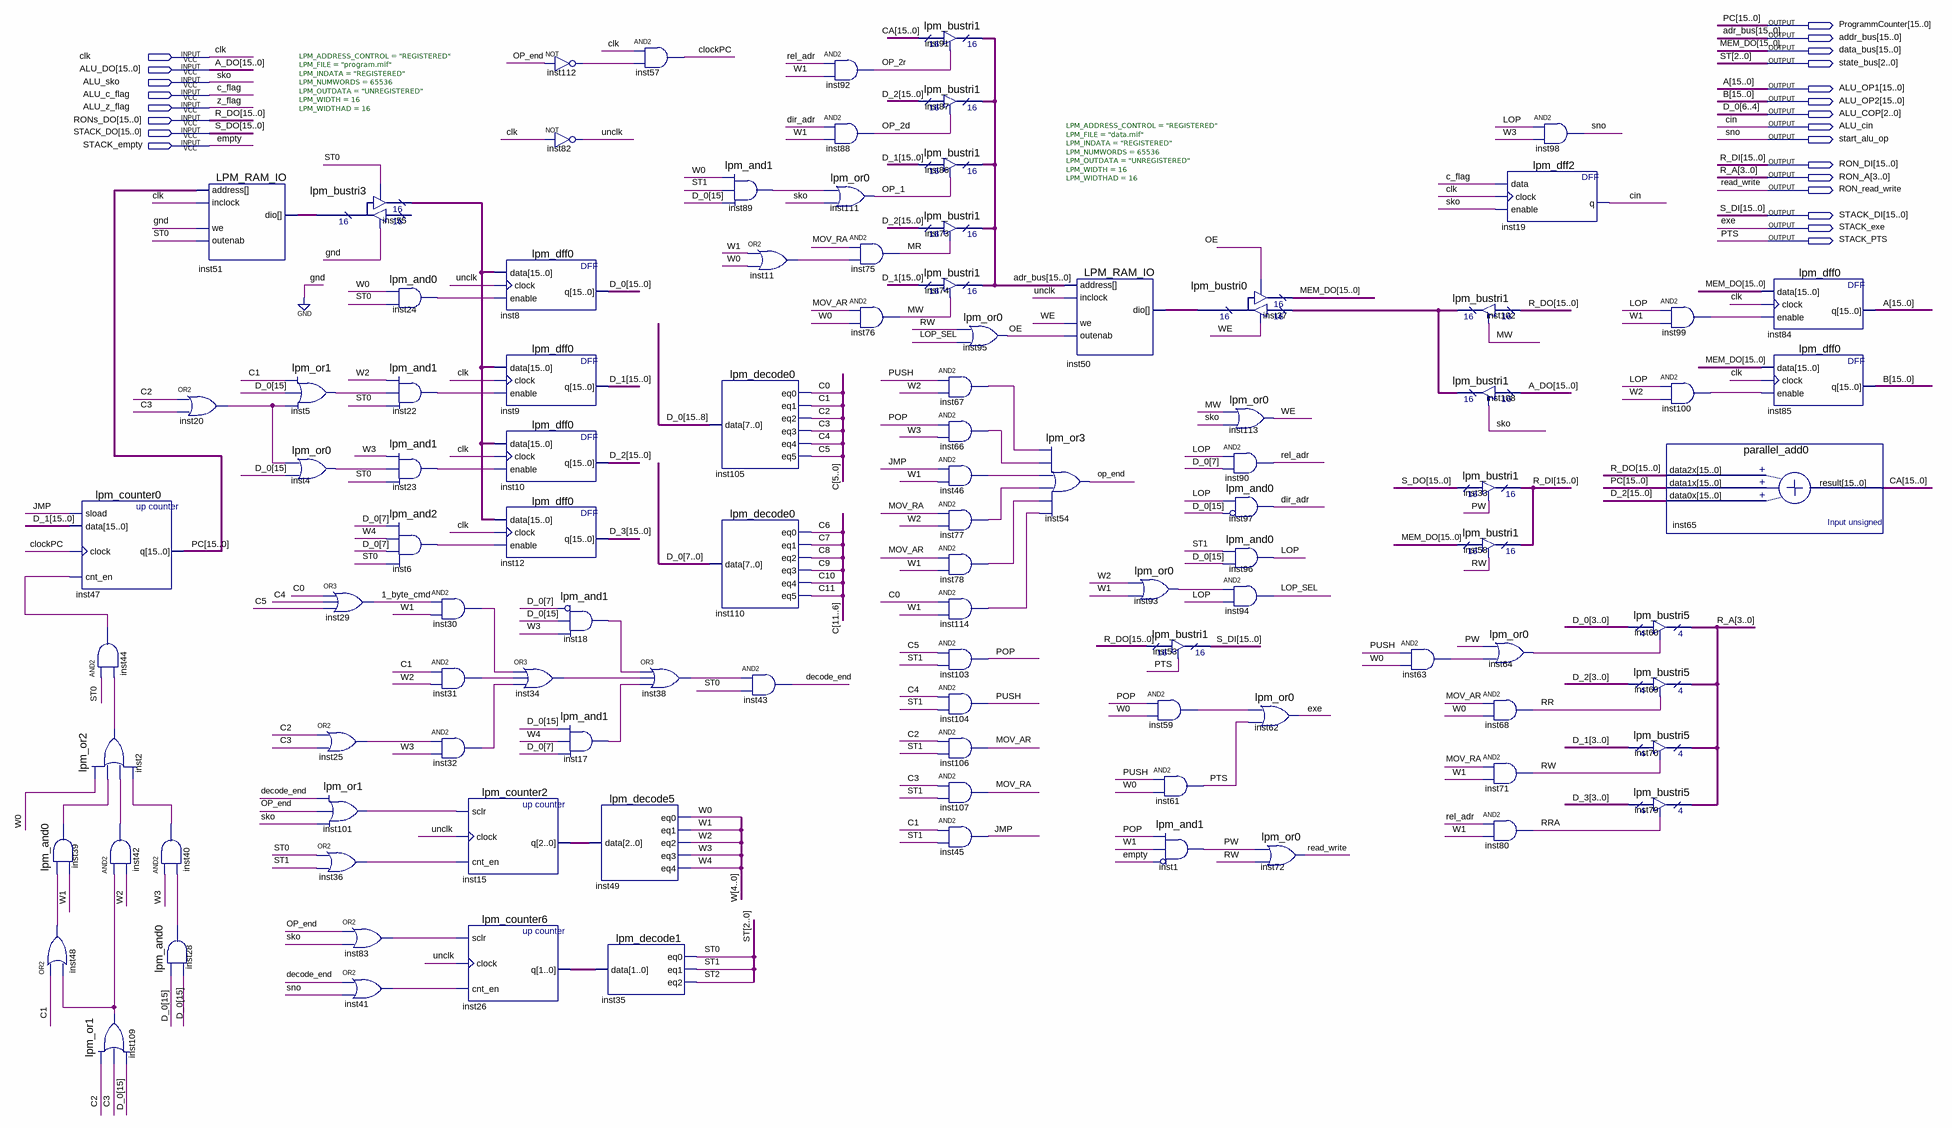
[diagram p0: schematic sheet]
// Quartus schematic CU.bdf as structural Verilog: 104 symbols, 23 pins
module CU (
  input  clk,
  input  [15:0] ALU_DO,
  input  ALU_sko,
  input  ALU_c_flag,
  input  ALU_z_flag,
  input  [15:0] RONs_DO,
  input  [15:0] STACK_DO,
  input  STACK_empty,
  output [15:0] ProgrammCounter,
  output [15:0] addr_bus,
  output [15:0] data_bus,
  output [2:0] state_bus,
  output [15:0] ALU_OP1,
  output [15:0] ALU_OP2,
  output [2:0] ALU_COP,
  output ALU_cin,
  output start_alu_op,
  output [15:0] RON_DI,
  output [3:0] RON_A,
  output RON_read_write,
  output [15:0] STACK_DI,
  output STACK_exe,
  output STACK_PTS
);

  wire \1_byte_cmd , clockPC, decode_end, dir_adr, inst2_result, inst4_result, inst5_result, inst6_result,
       inst11_out, inst17_result, inst18_result, inst20_out, inst22_result, inst23_result, inst24_result,
       inst25_out, inst28_result, inst30_out, inst31_out, inst32_out, inst34_out, inst36_out, inst38_out,
       inst39_result, inst40_out, inst41_out, inst42_out, inst44_out, inst46_out, inst48_out, inst59_out,
       inst63_out, inst64_result, inst66_out, inst67_out, inst77_out, inst78_out, inst83_out, inst89_result,
       inst93_result, inst99_out, inst100_out, inst101_result, inst109_result, inst112_out, inst114_out, JMP,
       LOP, LOP_SEL, MOV_AR, MOV_RA, MR, MW, OE, OP_1, OP_2d, OP_2r, op_end, POP, PUSH, PW, rel_adr, RR, RRA,
       RW, unclk, WE;
  wire [1:0] inst26_q;
  wire [2:0] inst15_q;
  wire [4:0] W;
  wire [11:0] C;
  wire [15:0] CA, D_0, D_1, D_2, D_3, inst50_dio, inst51_dio, inst55_result, inst102_tridata;

  lpm_counter0 inst47 (.sload(JMP), .data(D_1), .clock(clockPC), .cnt_en(inst44_out), .q(ProgrammCounter));
  lpm_and0 inst39 (.data0(inst48_out), .data1(W[1]), .result(inst39_result));
  or inst48 (inst48_out, C[1], inst109_result);
  and inst44 (inst44_out, state_bus[0], inst2_result);
  lpm_or2 inst2 (.data0(W[0]), .data1(inst39_result), .data2(inst42_out), .data3(inst40_out), .result(inst2_result));
  and inst42 (inst42_out, inst109_result, W[2]);
  lpm_or1 inst109 (.data0(C[2]), .data1(C[3]), .data2(D_0[15]), .result(inst109_result));
  and inst40 (inst40_out, W[3], inst28_result);
  lpm_and0 inst28 (.data0(D_0[15]), .data1(D_0[15]), .result(inst28_result));
  LPM_RAM_IO #(.LPM_ADDRESS_CONTROL("REGISTERED"), .LPM_FILE("program.mif"), .LPM_INDATA("REGISTERED"), .LPM_NUMWORDS(65536), .LPM_OUTDATA("UNREGISTERED"), .LPM_WIDTH(16), .LPM_WIDTHAD(16)) inst51 (
    .address(ProgrammCounter), .inclock(clk), .we(1'b0), .outenab(state_bus[0]), .dio(inst51_dio));
  or inst20 (inst20_out, C[2], C[3]);
  lpm_bustri3 inst55 (
    .enabledt(1'b0), .enabletr(state_bus[0]), .result(inst55_result), .tridata(inst51_dio));  // open: data
  lpm_or1 inst5 (.data0(C[1]), .data1(D_0[15]), .data2(inst20_out), .result(inst5_result));
  lpm_or0 inst4 (.data0(inst20_out), .data1(D_0[15]), .result(inst4_result));
  or inst29 (\1_byte_cmd , C[0], C[4], C[5]);
  or inst25 (inst25_out, C[2], C[3]);
  lpm_or1 inst101 (.data0(decode_end), .data1(op_end), .data2(ALU_sko), .result(inst101_result));
  or inst36 (inst36_out, state_bus[0], state_bus[1]);
  or inst83 (inst83_out, op_end, ALU_sko);
  or inst41 (inst41_out, decode_end, start_alu_op);
  lpm_and0 inst24 (.data0(W[0]), .data1(state_bus[0]), .result(inst24_result));
  lpm_and1 inst22 (.data0(W[2]), .data1(inst5_result), .data2(state_bus[0]), .result(inst22_result));
  lpm_and1 inst23 (.data0(W[3]), .data1(inst4_result), .data2(state_bus[0]), .result(inst23_result));
  lpm_and2 inst6 (.data0(D_0[7]), .data1(W[4]), .data2(D_0[7]), .data3(state_bus[0]), .result(inst6_result));
  and inst30 (inst30_out, \1_byte_cmd , W[1]);
  and inst31 (inst31_out, C[1], W[2]);
  and inst32 (inst32_out, inst25_out, W[3]);
  lpm_counter2 inst15 (.sclr(inst101_result), .clock(unclk), .cnt_en(inst36_out), .q(inst15_q));
  lpm_counter6 inst26 (.sclr(inst83_out), .clock(unclk), .cnt_en(inst41_out), .q(inst26_q));
  lpm_dff0 inst8 (.data(inst55_result), .clock(unclk), .enable(inst24_result), .q({D_0[15:7], ALU_COP, D_0[3:0]}));
  lpm_dff0 inst9 (.data(inst55_result), .clock(clk), .enable(inst22_result), .q(D_1));
  lpm_dff0 inst10 (.data(inst55_result), .clock(clk), .enable(inst23_result), .q(D_2));
  lpm_dff0 inst12 (.data(inst55_result), .clock(clk), .enable(inst6_result), .q(D_3));
  or inst34 (inst34_out, inst30_out, inst31_out, inst32_out);
  not inst112 (inst112_out, op_end);
  not inst82 (unclk, clk);
  lpm_and1 inst18 (.data0(~D_0[7]), .data1(D_0[15]), .data2(W[3]), .result(inst18_result));
  lpm_and1 inst17 (.data0(D_0[15]), .data1(W[4]), .data2(D_0[7]), .result(inst17_result));
  lpm_decode5 inst49 (.data(inst15_q), .eq0(W[0]), .eq1(W[1]), .eq2(W[2]), .eq3(W[3]), .eq4(W[4]));
  lpm_decode1 inst35 (.data(inst26_q), .eq0(state_bus[0]), .eq1(state_bus[1]), .eq2(state_bus[2]));
  and inst57 (clockPC, clk, inst112_out);
  or inst38 (inst38_out, inst18_result, inst34_out, inst17_result);
  lpm_and1 inst89 (.data0(W[0]), .data1(state_bus[1]), .data2(D_0[15]), .result(inst89_result));
  lpm_decode0 inst105 (.data(D_0[15:8]), .eq0(C[0]), .eq1(C[1]), .eq2(C[2]), .eq3(C[3]), .eq4(C[4]), .eq5(C[5]));
  lpm_decode0 inst110 (
    .data({D_0[7], ALU_COP, D_0[3:0]}), .eq0(C[6]), .eq1(C[7]), .eq2(C[8]), .eq3(C[9]), .eq4(C[10]),
    .eq5(C[11]));
  or inst11 (inst11_out, W[1], W[0]);
  and inst43 (decode_end, inst38_out, state_bus[0]);
  and inst92 (OP_2r, rel_adr, W[1]);
  and inst88 (OP_2d, dir_adr, W[1]);
  lpm_or0 inst111 (.data0(inst89_result), .data1(ALU_sko), .result(OP_1));
  and inst75 (MR, MOV_RA, inst11_out);
  and inst76 (MW, MOV_AR, W[0]);
  lpm_bustri1 inst91 (.enabledt(OP_2r), .data(CA), .tridata(addr_bus));
  lpm_bustri1 inst87 (.enabledt(OP_2d), .data(D_2), .tridata(addr_bus));
  lpm_bustri1 inst86 (.enabledt(OP_1), .data(D_1), .tridata(addr_bus));
  lpm_bustri1 inst73 (.enabledt(MR), .data(D_2), .tridata(addr_bus));
  lpm_bustri1 inst74 (.enabledt(MW), .data(D_1), .tridata(addr_bus));
  lpm_or0 inst95 (.data0(RW), .data1(LOP_SEL), .result(OE));
  and inst67 (inst67_out, PUSH, W[2]);
  and inst66 (inst66_out, POP, W[3]);
  and inst46 (inst46_out, JMP, W[1]);
  and inst77 (inst77_out, MOV_RA, W[2]);
  and inst78 (inst78_out, MOV_AR, W[1]);
  and inst114 (inst114_out, C[0], W[1]);
  and inst103 (POP, C[5], state_bus[1]);
  and inst104 (PUSH, C[4], state_bus[1]);
  and inst106 (MOV_AR, C[2], state_bus[1]);
  and inst107 (MOV_RA, C[3], state_bus[1]);
  and inst45 (JMP, C[1], state_bus[1]);
  LPM_RAM_IO #(.LPM_ADDRESS_CONTROL("REGISTERED"), .LPM_FILE("data.mif"), .LPM_INDATA("REGISTERED"), .LPM_NUMWORDS(65536), .LPM_OUTDATA("UNREGISTERED"), .LPM_WIDTH(16), .LPM_WIDTHAD(16)) inst50 (
    .address(addr_bus), .inclock(unclk), .we(WE), .outenab(OE), .dio(inst50_dio));
  lpm_or3 inst54 (
    .data0(inst67_out), .data1(inst66_out), .data2(inst46_out), .data3(inst77_out), .data4(inst78_out),
    .data5(inst114_out), .result(op_end));
  lpm_or0 inst93 (.data0(W[2]), .data1(W[1]), .result(inst93_result));
  lpm_bustri1 inst53 (.enabledt(STACK_PTS), .data(RONs_DO), .tridata(STACK_DI));
  and inst59 (inst59_out, POP, W[0]);
  and inst61 (STACK_PTS, PUSH, W[0]);
  lpm_and1 inst1 (.data0(POP), .data1(W[1]), .data2(~STACK_empty), .result(PW));
  lpm_bustri0 inst37 (.enabledt(WE), .data(inst102_tridata), .enabletr(OE), .result(data_bus), .tridata(inst50_dio));
  lpm_or0 inst113 (.data0(MW), .data1(ALU_sko), .result(WE));
  and inst90 (rel_adr, LOP, D_0[7]);
  lpm_and0 inst97 (.data0(LOP), .data1(~D_0[15]), .result(dir_adr));
  lpm_and0 inst96 (.data0(state_bus[1]), .data1(D_0[15]), .result(LOP));
  and inst94 (LOP_SEL, inst93_result, LOP);
  lpm_or0 inst62 (.data0(inst59_out), .data1(STACK_PTS), .result(STACK_exe));
  lpm_or0 inst72 (.data0(PW), .data1(RW), .result(RON_read_write));
  and inst63 (inst63_out, PUSH, W[0]);
  lpm_bustri1 inst102 (.enabledt(MW), .data(RONs_DO), .tridata(inst102_tridata));
  lpm_bustri1 inst108 (.enabledt(ALU_sko), .data(ALU_DO), .tridata(inst102_tridata));
  lpm_bustri1 inst33 (.enabledt(PW), .data(STACK_DO), .tridata(RON_DI));
  lpm_bustri1 inst58 (.enabledt(RW), .data(data_bus), .tridata(RON_DI));
  lpm_or0 inst64 (.data0(PW), .data1(inst63_out), .result(inst64_result));
  and inst68 (RR, MOV_AR, W[0]);
  and inst71 (RW, MOV_RA, W[1]);
  and inst80 (RRA, rel_adr, W[1]);
  and inst98 (start_alu_op, LOP, W[3]);
  lpm_dff2 inst19 (.data(ALU_c_flag), .clock(clk), .enable(ALU_sko), .q(ALU_cin));
  lpm_bustri5 inst60 (.enabledt(inst64_result), .data(D_0[3:0]), .tridata(RON_A));
  lpm_bustri5 inst69 (.enabledt(RR), .data(D_2[3:0]), .tridata(RON_A));
  lpm_bustri5 inst70 (.enabledt(RW), .data(D_1[3:0]), .tridata(RON_A));
  lpm_bustri5 inst79 (.enabledt(RRA), .data(D_3[3:0]), .tridata(RON_A));
  and inst99 (inst99_out, LOP, W[1]);
  and inst100 (inst100_out, LOP, W[2]);
  parallel_add0 inst65 (.data2x(RONs_DO), .data1x(ProgrammCounter), .data0x(D_2), .result(CA));
  lpm_dff0 inst84 (.data(data_bus), .clock(clk), .enable(inst99_out), .q(ALU_OP1));
  lpm_dff0 inst85 (.data(data_bus), .clock(clk), .enable(inst100_out), .q(ALU_OP2));

  // Other names for the same wires on the sheet: A[15:0] = ALU_OP1; A_DO[15:0] = ALU_DO; adr_bus[15:0] = addr_bus;
  //   B[15:0] = ALU_OP2; c_flag = ALU_c_flag; cin = ALU_cin; D_0[6:4] = ALU_COP; empty = STACK_empty; exe = STACK_exe;
  //   MEM_DO[15:0] = data_bus; PC[15:0] = ProgrammCounter; PTS = STACK_PTS; R_A[3:0] = RON_A; R_DI[15:0] = RON_DI;
  //   R_DO[15:0] = RONs_DO; read_write = RON_read_write; S_DI[15:0] = STACK_DI; S_DO[15:0] = STACK_DO; sko = ALU_sko;
  //   sno = start_alu_op; ST[2:0] = state_bus; ST0 = state_bus[0]; ST1 = state_bus[1]; ST2 = state_bus[2];
  //   z_flag = ALU_z_flag
endmodule
